# EAGLE design wheel_board_rear (EAGLE 9.5.0)
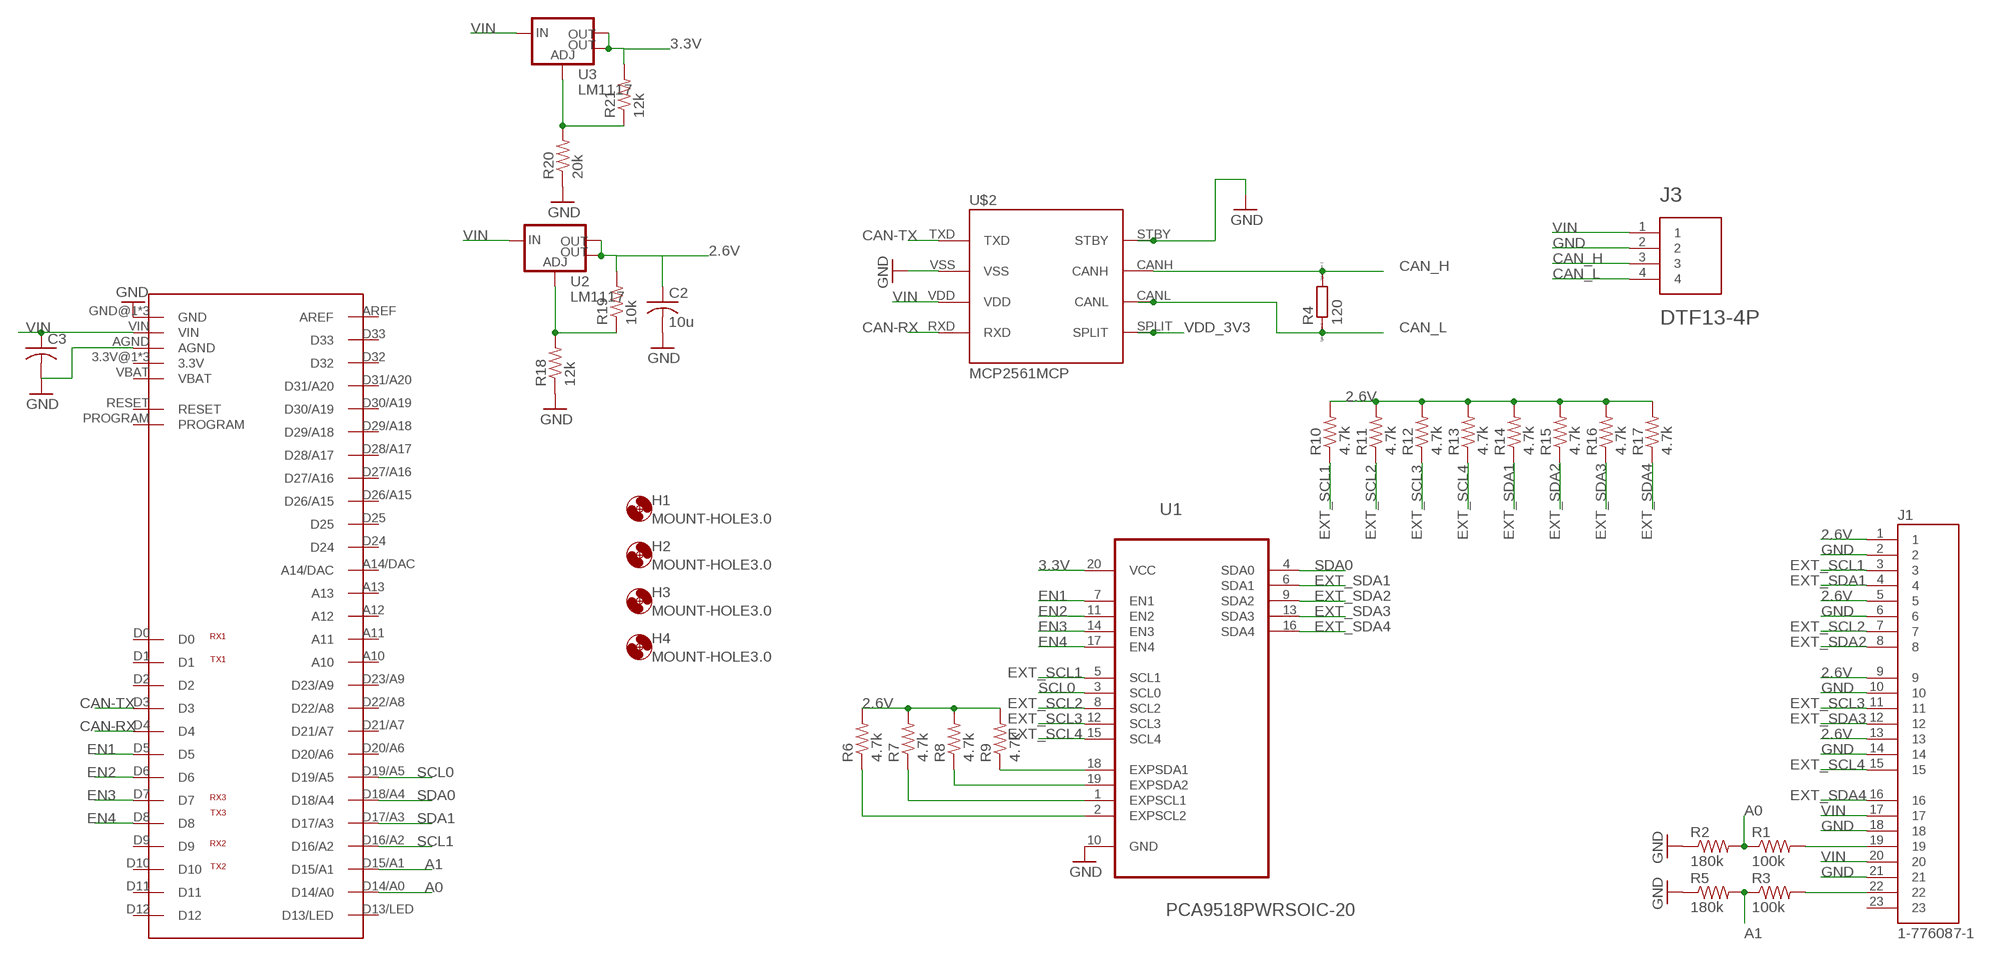
[diagram p0: schematic, sheet 1]

## Parts
C2  10u  C-US050-024X044  [C050-024X044]
C3  C-US050-024X044  [C050-024X044]
H1  MOUNT-HOLE3.0  [3,0]
H2  MOUNT-HOLE3.0  [3,0]
H3  MOUNT-HOLE3.0  [3,0]
H4  MOUNT-HOLE3.0  [3,0]
J1  1-776087-1  [TE_1-776087-1]
J3  DTF13-4P  [TE_DTF13-4P]
R1  100k  R-US_0204/7  [0204/7]
R2  180k  R-US_0204/7  [0204/7]
R3  100k  R-US_0204/7  [0204/7]
R4  120  R  [R0805]
R5  180k  R-US_0204/7  [0204/7]
R6  4.7k  R-US_0204/7  [0204/7]
R7  4.7k  R-US_0204/7  [0204/7]
R8  4.7k  R-US_0204/7  [0204/7]
R9  4.7k  R-US_0204/7  [0204/7]
R10  4.7k  R-US_0204/7  [0204/7]
R11  4.7k  R-US_0204/7  [0204/7]
R12  4.7k  R-US_0204/7  [0204/7]
R13  4.7k  R-US_0204/7  [0204/7]
R14  4.7k  R-US_0204/7  [0204/7]
R15  4.7k  R-US_0204/7  [0204/7]
R16  4.7k  R-US_0204/7  [0204/7]
R17  4.7k  R-US_0204/7  [0204/7]
R18  12k  R-US_0204/7  [0204/7]
R19  10k  R-US_0204/7  [0204/7]
R20  20k  R-US_0204/7  [0204/7]
R21  12k  R-US_0204/7  [0204/7]
U1  PCA9518PWRSOIC-20  [SOIC127P1032X265-20N]
U2  LM1117  V_REG_LM1117SOT223  [SOT223]
U3  LM1117  V_REG_LM1117SOT223  [SOT223]
U$1  TEENSY3.1_ALL  [TEENSY3.1_ALL]
U$2  MCP2561MCP  [MCP2561_PDIP]

## Nets
2.6V [pwr]: C2.1 J1.1 J1.5 J1.9 J1.13 R6.2 R7.2 R8.2 R9.2 R10.2 R11.2 R12.2 R13.2 R14.2 R15.2 R16.2 R17.2 R19.2 U2.2(OUT) U2.4(OUT)
3.3V [pwr]: R21.2 U1.20(VCC) U3.2(OUT) U3.4(OUT)
A0: R1.1 R2.2 U$1.D14/A0
A1: R3.1 R5.2 U$1.D15/A1
CAN-RX: U$1.D4 U$2.RXD
CAN-TX: U$1.D3 U$2.TXD
CAN_H: J3.3 R4.2 U$2.CANH
CAN_L: J3.4 R4.1 U$2.CANL
EN1: U1.7(EN1) U$1.D5
EN2: U1.11(EN2) U$1.D6
EN3: U1.14(EN3) U$1.D7
EN4: U1.17(EN4) U$1.D8
EXT_SCL1: J1.3 R10.1 U1.5(SCL1)
EXT_SCL2: J1.7 R11.1 U1.8(SCL2)
EXT_SCL3: J1.11 R12.1 U1.12(SCL3)
EXT_SCL4: J1.15 R13.1 U1.15(SCL4)
EXT_SDA1: J1.4 R14.1 U1.6(SDA1)
EXT_SDA2: J1.8 R15.1 U1.9(SDA2)
EXT_SDA3: J1.12 R16.1 U1.13(SDA3)
EXT_SDA4: J1.16 R17.1 U1.16(SDA4)
GND [pwr]: C2.2 C3.2 J1.2 J1.6 J1.10 J1.14 J1.18 J1.21 J3.2 R2.1 R5.1 R18.1 R20.1 U1.10(GND) U$1.AGND U$1.GND@1(GND) U$1.GND@2(GND) U$1.GND@3(GND) U$2.STBY U$2.VSS
N$1: R9.1 U1.18(EXPSDA1)
N$2: R8.1 U1.19(EXPSDA2)
N$3: R7.1 U1.1(EXPSCL1)
N$4: R6.1 U1.2(EXPSCL2)
N$5 [pwr]: R20.2 R21.1 U3.1(ADJ)
N$6: J1.19 R1.2
N$7: J1.22 R3.2
N$14 [pwr]: R18.2 R19.1 U2.1(ADJ)
SCL0: U1.3(SCL0) U$1.D19/A5
SCL1: U$1.D16/A2
SDA0: U1.4(SDA0) U$1.D18/A4
SDA1: U$1.D17/A3
VDD_3V3: U$2.SPLIT
VIN [pwr]: C3.1 J1.17 J1.20 J3.1 U2.3(IN) U3.3(IN) U$1.VIN U$2.VDD
Unconnected: J1.23 U$1.3.3V@1(3.3V) U$1.3.3V@2(3.3V) U$1.3.3V@3(3.3V) U$1.A10 U$1.A11 U$1.A12 U$1.A13 U$1.A14/DAC U$1.AREF U$1.D0 U$1.D1 U$1.D2 U$1.D9 U$1.D10 U$1.D11 U$1.D12 U$1.D13/LED U$1.D20/A6 U$1.D21/A7 U$1.D22/A8 U$1.D23/A9 U$1.D24 U$1.D25 U$1.D26/A15 U$1.D27/A16 U$1.D28/A17 U$1.D29/A18 U$1.D30/A19 U$1.D31/A20 U$1.D32 U$1.D33 U$1.PROGRAM U$1.RESET U$1.VBAT

## Library data of the parts
C2 C3 = rcl:C-US: CAPACITOR, American symbol; SPICEPREFIX: C
H1-H4 = holes:MOUNT-HOLE: MOUNTING HOLE with drill center marker
J1 = 1-776087-1:1-776087-1: 23 Positions Header Connector 0.157" (4.00mm) Panel Mount, Through Hole, Right Angle Gold-Palladium, Black; AVAILABILITY: Unavailable; COMMENT: 1-776087-1; DESCRIPTION: AMPSEAL Series; 4mm Pitch 23 Way 3 Row Right Angle PCB Header; Solder Term; 8A; EU_ROHS_COMPLIANCE: Compliant; MF: TE Connectivity; MP: 1-776087-1; PACKAGE: None; PRICE: None; TE_PURCHASE_URL: https://www.te.com/usa-en/product-1-776087-1.html?te_bu=Cor&te_type=disp&te_campaign=seda_glo_cor-seda-global-disp-prtnr-fy19-seda-model-bom-cta_sma-317_1&elqCampaignId=32493
J3 = DTF13-4P:DTF13-4P: none; AVAILABILITY: In stock; MF: TE Connectivity; MPN: DTF13-4P; PARTREV: NC; STANDARD: Manufacturer recommendation
R1-R3 R5-R21 = rcl:R-US_: RESISTOR, American symbol; SPICEPREFIX: R
R4 = eagle-ltspice:R: RESISTOR, European symbol; SPICEMODEL: NONE; SPICEPREFIX: R
U1 = PCA9518PWR:PCA9518PWR: EXPANDABLE FIVE-CHANNEL I2C HUB
U2 U3 = SparkFun-IC-Power:V_REG_LM1117: Voltage Regulator LM1117 Standard adjustable voltage regulator but in SMD form. Spark Fun Electronics SKU : COM-00595; PROD_ID: VREG-08170
U$1 = Teensy3.1:TEENSY3.1_ALL
U$2 = PoJD:MCP2561: High-Speed CAN Transceiver See http://ww1.microchip.com/downloads/en/DeviceDoc/25167A.pdf The MCP2561/2 is a Microchip Technology Inc. second generation high-speed CAN transceiver. It serves as an interface between a CAN protocol controller and the physical two-wire CAN bus. The device meets the automotive requirements for high-speed (up to 1 Mb/s), low quiescent current, electromagnetic compatibility (EMC) and electrostatic discharge (ESD).

## Net classes
0 default: width 0.508 mm, drill 0.254 mm
1 pwr: width 1.143 mm, clearance 0.381 mm

## Board
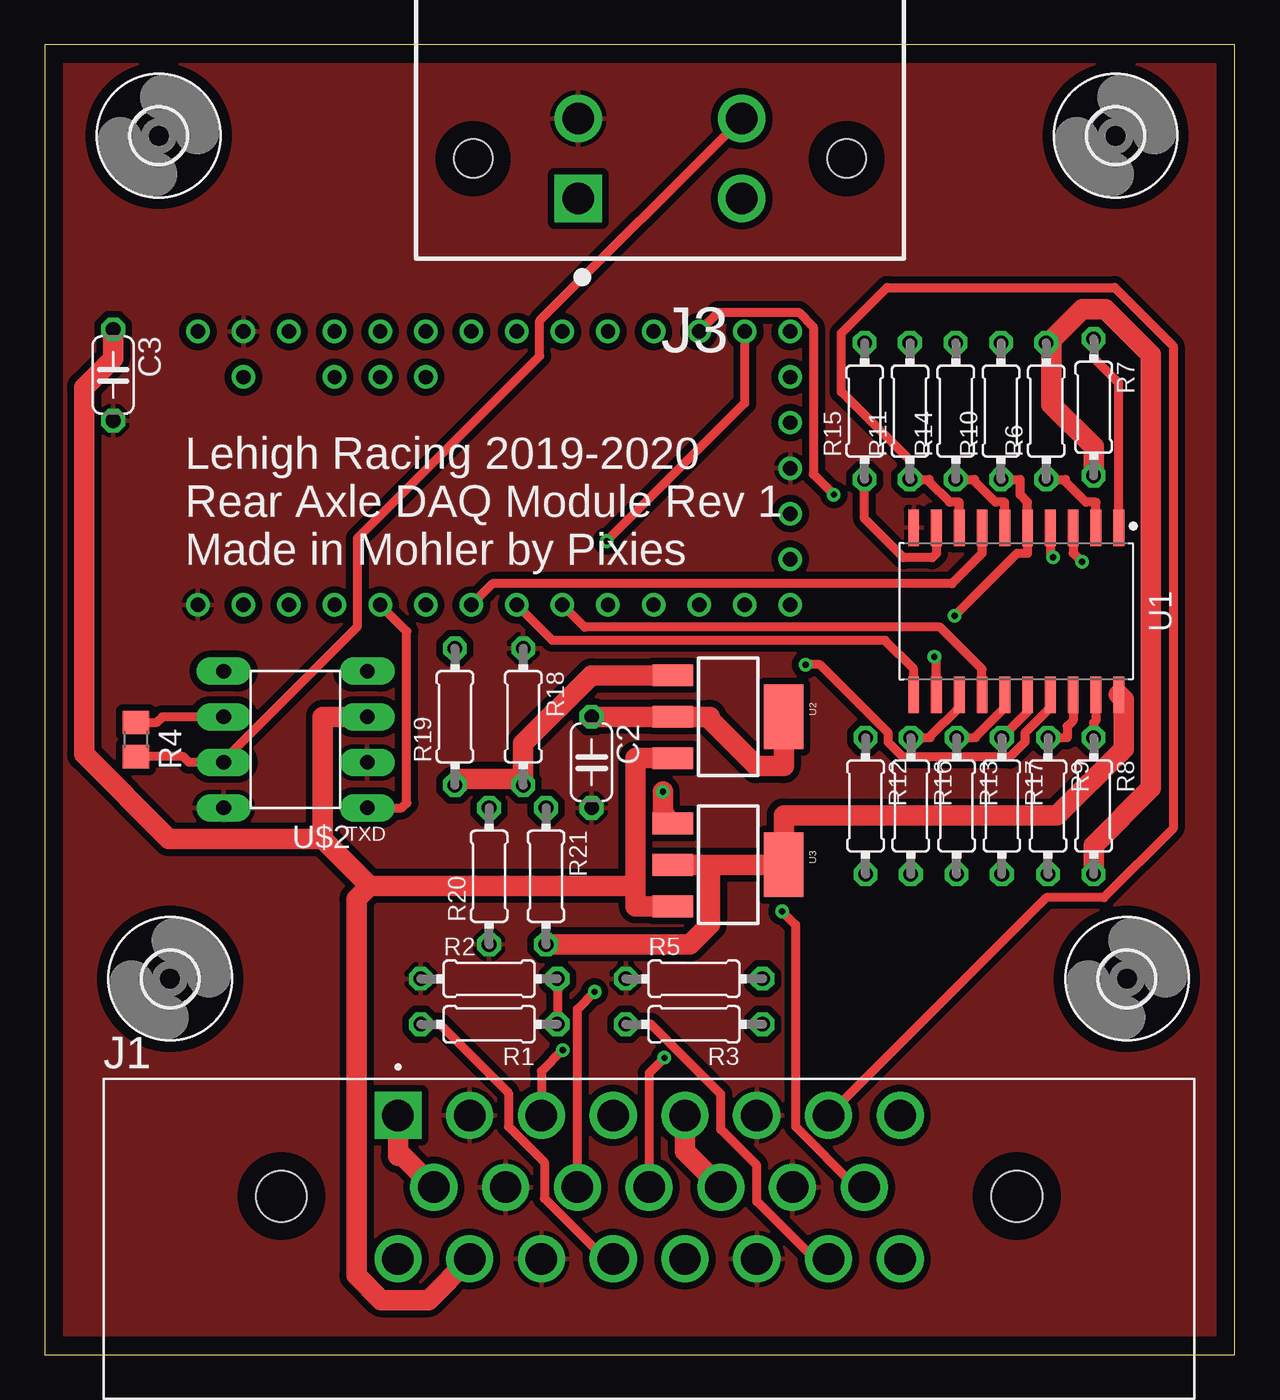
[diagram p1: board, top side]
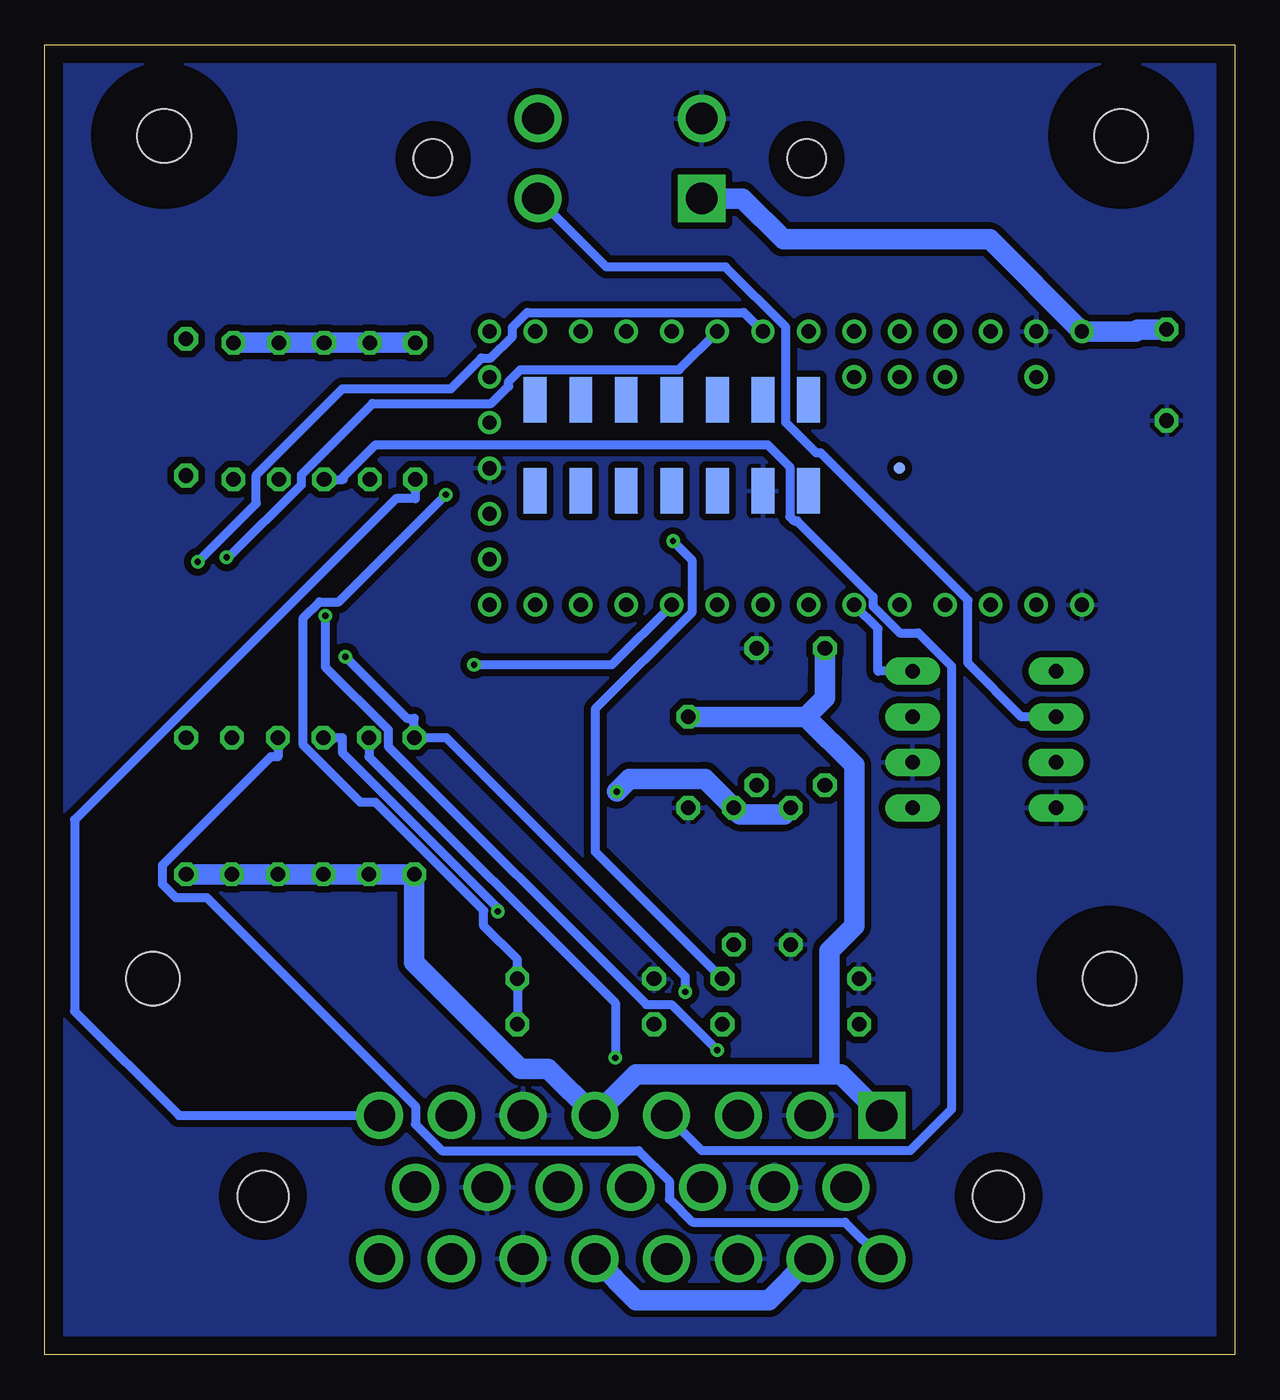
[diagram p2: board, bottom side, seen from below]

Size 66.34 x 73.02 mm. Coordinates in mm from the lower left corner, seen from the top.
Outline: 0,0 66.34,0 66.34,73.02 0,73.02 0,0
Copper layers (1*16): Top 0.035mm / dielectric 1.5mm / Bottom 0.035mm
Design rules "default": minimum track width 6mil, minimum drill 0.35mm, track to track 6mil, track to pad 6mil, pad to pad 6mil, via to via 6mil, smd to smd 6mil, copper to edge 40mil, drill to drill 6mil, minimum pad ring 10mil, minimum via ring 8mil, stop-mask expansion 4mil, vias tented up to drill 0mil, thermal gap 10mil

### Footprints (pad centres in the part's own frame; a part is rotated, then mirrored left to right if it is on the bottom)
C050-024X044 = drill 0.813 octagon: 1 -2.54,0; 2 2.54,0
3,0 = hole 3: 0,0
TE_1-776087-1 = drill 1.75 square: 1 0,0 | drill 1.75: 2 4,0; 3 8,0; 4 12,0; 5 16,0; 6 20,0; 7 24,0; 8 28,0; 9 2,-4; 10 6,-4; 11 10,-4; 12 14,-4; 13 18,-4; 14 22,-4; 15 26,-4; 16 0,-8; 17 4,-8; 18 8,-8; 19 12,-8; 20 16,-8; 21 20,-8; 22 24,-8; 23 28,-8 | hole 2.85: -6.5,-4.5; 34.5,-4.5
TE_DTF13-4P = drill 1.76 square: 1 4.561,2.223 | drill 1.76: 2 4.561,-2.227; 3 -4.559,-2.227; 4 -4.559,2.223 | hole 2.16: -10.415,0; 10.415,0
0204/7 = drill 0.813 octagon: 1 -3.81,0; 2 3.81,0
R0805 = smd 1.3 x 1.5: 1 -0.95,0; 2 0.95,0
SOIC127P1032X265-20N = smd 2.052 x 0.602: 1 -4.654,5.715; 2 -4.654,4.445; 3 -4.654,3.175; 4 -4.654,1.905; 5 -4.654,0.635; 6 -4.654,-0.635; 7 -4.654,-1.905; 8 -4.654,-3.175; 9 -4.654,-4.445; 10 -4.654,-5.715; 11 4.654,-5.715; 12 4.654,-4.445; 13 4.654,-3.175; 14 4.654,-1.905; 15 4.654,-0.635; 16 4.654,0.635; 17 4.654,1.905; 18 4.654,3.175; 19 4.654,4.445; 20 4.654,5.715
SOT223 = smd 1.219 x 2.235: 1 -2.311,-3.099; 2 0,-3.099; 3 2.311,-3.099 | smd 3.6 x 2.2: 4 0,3.099
TEENSY3.1_ALL = drill 0.8: 3.3V@1 2.54,5.08; 3.3V@2 -7.62,-22.86; A10 0,0; A11 0,-2.54; A14/DAC 0,-22.86; AGND 2.54,7.62; AREF 0,2.54; D0 -12.7,7.62; D1 -12.7,5.08; D2 -12.7,2.54; D3 -12.7,0; D4 -12.7,-2.54; D5 -12.7,-5.08; D6 -12.7,-7.62; D7 -12.7,-10.16; D8 -12.7,-12.7; D9 -12.7,-15.24; D10 -12.7,-17.78; D11 -12.7,-20.32; D12 -12.7,-22.86; D13/LED 2.54,-22.86; D14/A0 2.54,-20.32; D15/A1 2.54,-17.78; D16/A2 2.54,-15.24; D17/A3 2.54,-12.7; D18/A4 2.54,-10.16; D19/A5 2.54,-7.62; D20/A6 2.54,-5.08; D21/A7 2.54,-2.54; D22/A8 2.54,0; D23/A9 2.54,2.54; GND@1 -12.7,10.16; GND@2 -5.08,-22.86; PROGRAM -2.54,-22.86; VBAT -10.16,-22.86; VIN 2.54,10.16; VUSB 0,7.62 | smd 2.54 x 1.27 bottom: 3.3V@3 -1.27,-7.62; A12 -6.35,-5.08; A13 -1.27,-5.08; D24 -6.35,-10.16; D25 -6.35,-12.7; D26/A15 -6.35,-15.24; D27/A16 -6.35,-17.78; D28/A17 -6.35,-20.32; D29/A18 -1.27,-20.32; D30/A19 -1.27,-17.78; D31/A20 -1.27,-15.24; D32 -1.27,-12.7; D33 -1.27,-10.16; GND@3 -6.35,-7.62 | smd 0.635 x 0.635 bottom: RESET -5.08,0
MCP2561_PDIP = drill 0.813 pad 1.524 long: CANH 4,1.27; CANL 4,-1.27; RXD -4,-3.81; SPLIT 4,-3.81; STBY 4,3.81; TXD -4,3.81; VDD -4,-1.27; VSS -4,1.27

### Placement (x,y rotation side)
C2  30.48,33.02 270 top
C3  3.81,54.61 270 top
H1  60.33,20.96 0 top
H2  6.98,20.96 0 top
H3  59.69,67.95 0 top
H4  6.35,67.95 0 top
J1  19.68,13.34 0 top
J3  34.29,66.67 180 top
R1  24.77,18.41 180 top
R2  24.77,20.96 0 top
R3  36.2,18.41 180 top
R4  5.08,34.29 270 top
R5  36.2,20.96 0 top
R6  55.83,52.6 90 top
R7  58.47,52.81 270 top
R8  58.47,30.59 270 top
R9  55.92,30.59 270 top
R10  53.3,52.6 90 top
R11  48.23,52.6 90 top
R12  45.75,30.59 270 top
R13  50.83,30.59 270 top
R14  50.78,52.6 90 top
R15  45.7,52.6 90 top
R16  48.27,30.59 270 top
R17  53.35,30.59 270 top
R18  26.67,35.56 270 top
R19  22.86,35.56 90 top
R20  24.77,26.67 90 top
R21  27.94,26.67 270 top
U1  54.15,41.44 270 top
U2  38.1,35.56 270 top
U3  38.1,27.3 270 top
U$1  18.69,54.5 90 top
U$2  13.97,34.29 180 top

### Tracks (layer width: path | path; a pad name or v marks a point on that pad's centre or on a via)
2.6V
  Top 1.143: U2.4 41.2,32.81 39.66,32.81 37.07,35.4 37.07,35.56 U2.2 C2.1 | 56.11,56.41 56.11,52.97 58.47,50.62 R7.2 | 56.11,56.41 56.11,56.55 57.85,58.28 59.12,58.28 61.66,55.74 61.66,31.59 58.47,28.39 R8.2 | 56.11,56.41 R6.2 | J1.1 19.68,11.07 19.95,11.07 J1.9 | J1.13 35.69,11.34 J1.5
  Bottom 1.143: 23.92,35.56 22.86,36.62 22.86,37.76 R19.2 | C2.1 23.92,35.56 | 22.6,15.63 22.6,22.52 21.22,23.9 21.22,32.86 23.92,35.56 | 22.6,15.63 21.98,15.63 J1.1 | 22.6,15.63 33.39,15.63 J1.5 38.29,15.94 39.81,15.94 45.75,21.88 R12.2 46.66,26.78 R16.2 R13.2 R17.2 R9.2 R8.2 | R6.2 R10.2 R14.2 R11.2 R15.2
3.3V
  Top 1.143: U1.20 60.14,36.51 60.14,33.77 56.43,30.06 41.2,30.06 U3.4 37.07,27.3 | 37.07,27.3 37.07,23.97 35.96,22.86 R21.2 | 37.07,27.3 36.69,27.3 U3.2
A0  (via drill 0.35 pad 0.76)
  Top 0.508: U$1.D14/A0 39.01,53.04 v31.33,45.35 | R2.2 R1.1
  Bottom 0.508: v31.33,45.35 30.27,44.3 30.27,41.37 35.66,35.98 35.66,28.04 R2.2
A1  (via drill 0.35 pad 0.76)
  Top 0.508: U$1.D15/A1 37.54,58.1 42.03,58.1 42.84,57.29 42.84,49.09 v43.99,47.94
  Bottom 0.508: v43.99,47.94 49.96,41.97 51.03,41.97 51.93,41.07 51.93,33.98 48.75,30.8 47.92,30.8 41.88,24.76 41.88,23.9 40.01,22.02 R5.2 R3.1
CAN-RX
  Bottom 0.508: U$1.D4 19.9,40.46 19.9,38.1 U$2.RXD
CAN-TX
  Top 0.508: U$2.TXD 19.9,30.48 20.17,30.75 20.17,40.32 U$1.D3
CAN_H
  Top 0.508: 9.67,33.02 9.84,33.02 17.42,40.6 17.42,45.51 27.58,55.67 27.58,57.64 J3.3 | U$2.CANH 9.67,33.02 | 9.67,33.02 8.04,33.02 7.72,33.34 R4.2 | 9.67,33.02
CAN_L
  Top 0.508: R4.1 6.24,35.24 6.56,35.56 U$2.CANL
  Bottom 0.508: U$2.CANL 11.9,35.56 14.88,38.54 14.88,42.05 23.09,50.26 23.34,50.26 25.04,51.97 25.04,57.27 28.4,60.63 35.02,60.63 J3.4
EN1
  Top 0.508: U1.7 52.24,44.66 50.57,42.98 24.96,42.98 U$1.D5
EN2
  Top 0.508: U1.11 48.44,38.22 46.84,39.81 28.3,39.81 U$1.D6
EN3
  Top 0.508: U1.14 52.24,38.22 49.91,40.56 30.09,40.56 U$1.D7
EN4  (via drill 0.35 pad 0.76)
  Top 0.508: U1.17 56.05,36.07 54.64,34.66 54.64,34.16 53.79,33.31 47.83,33.31 47.01,34.14 47.01,34.65 43.2,38.46 v42.42,38.46 | v42.42,38.46
  Bottom 0.508: v42.42,38.46 34.73,38.46 U$1.D8
EXT_SCL1  (via drill 0.35 pad 0.76)
  Top 0.508: R10.1 54.37,48.79 54.37,47.94 54.78,47.53 U1.5 54.78,45.38 54.78,44.66 54.19,44.66 v50.71,41.18 | v28.87,16.98 27.69,15.8 J1.3
  Bottom 0.508: v50.71,41.18 50.71,38.34 47.21,34.84 47.21,33.91 32.82,19.52 31.41,19.52 v28.87,16.98
EXT_SCL2
  Top 0.508: J1.7 55.83,25.48 59.04,25.48 62.9,29.34 62.9,56.23 59.63,59.49 46.95,59.49 44.4,56.94 44.4,53.68 48.23,49.86 R11.1 49.29,48.79 49.29,48.68 50.44,47.53 50.98,47.53 U1.8
EXT_SCL3  (via drill 0.35 pad 0.76)
  Top 0.508: J1.11 29.69,19.26 v30.65,20.22 | U1.12 49.7,38.78 v49.59,38.9
  Bottom 0.508: v49.59,38.9 46.15,35.46 45.75,35.46 R12.1 43.97,34.4 30.65,21.07 v30.65,20.22
EXT_SCL4  (via drill 0.35 pad 0.76)
  Top 0.508: v41.1,24.71 41.85,23.96 41.85,12.71 45.23,9.34 J1.15 | U1.15 53.52,36.07 51.89,34.45 51.89,34.4 R13.1
  Bottom 0.508: R13.1 49.76,34.4 49.76,33.57 41.1,24.91 v41.1,24.71
EXT_SDA1
  Top 0.508: R14.1 51.84,48.79 51.84,48.68 53,47.53 53.52,47.53 U1.6
  Bottom 0.508: R14.1 49.71,48.79 49.71,48.92 47.9,50.73 26.06,50.73 24.81,49.49 24.81,46.71 24.58,46.47 24.41,46.47 20.17,42.24 20.17,41.72 18.68,40.24 17.66,40.24 15.8,38.38 15.8,13.68 18.12,11.37 29.72,11.37 J1.4
EXT_SDA2
  Top 0.508: U1.9 49.7,44.66 49.48,44.43 47.87,44.43 45.7,46.6 R15.1
  Bottom 0.508: R15.1 45.7,47.72 46.77,47.72 64.68,29.81 64.68,19.15 58.87,13.34 J1.8
EXT_SDA3  (via drill 0.35 pad 0.76)
  Top 0.508: v34.54,16.55 33.69,15.69 J1.12 | R16.1 49.34,34.4 49.34,34.45 50.98,36.08 U1.13
  Bottom 0.508: R16.1 48.27,33.33 34.54,19.6 v34.54,16.55 | v34.54,16.55
EXT_SDA4
  Top 0.508: U1.16 54.78,35.83 R17.1
  Bottom 0.508: R17.1 53.35,33.33 53.75,33.33 59.8,27.28 59.8,26.23 59.04,25.48 57.32,25.48 45.69,13.85 45.69,12.85 44.2,11.37 33.24,11.37 31.53,9.66 31.53,8.68 30.24,7.39 21.74,7.39 J1.16
GND
  pour Top: 0,73.03 66.67,73.03 66.67,0 0,0
  pour Bottom: 0,73.03 66.67,73.03 66.67,0 0,0
N$1
  Top 0.508: R9.1 56.99,34.4 56.99,35.02 57.33,35.35 U1.18
N$2
  Top 0.508: U1.19 58.59,35.35 58.47,35.23 R8.1
N$3
  Top 0.508: R7.1 58.47,55.55 59.86,54.16 U1.1
N$4
  Top 0.508: R6.1 56.89,48.79 56.89,48.68 58.04,47.53 58.59,47.53 U1.2
N$5  (via drill 0.35 pad 0.76)
  Top 1.143: U3.1 34.46,30.16 v34.46,31.39
  Bottom 1.143: v34.46,31.39 33.75,32.09 29.55,32.09 R21.1 27.59,30.12 25.12,30.12 R20.2
N$6
  Top 0.508: R1.2 22.02,18.41 25.85,14.59 25.85,12.71 27.85,10.71 27.85,8.71 31.23,5.33 J1.19
N$7
  Top 0.508: J1.22 42.9,5.33 39.69,8.55 39.69,10.55 37.69,12.55 37.69,14.51 33.78,18.41 33.45,18.41 R3.2
N$14
  Top 1.143: 26.67,32.1 26.67,34.06 30.48,37.87 U2.1 | R18.2 26.67,32.1 | 26.67,32.1 23.21,32.1 R19.1
SCL0  (via drill 0.35 pad 0.76)
  Top 0.508: U1.3 57.33,44.66 57.35,44.66 v57.82,44.19
  Bottom 0.508: v57.82,44.19 54.56,47.45 54.56,49.04 49.76,53.84 43.71,53.84 42,55.56 41.49,55.56 40.28,56.76 40.28,57.27 39.46,58.1 27.37,58.1 U$1.D19/A5
SDA0  (via drill 0.35 pad 0.76)
  Top 0.508: U1.4 56.05,44.66 56.21,44.5 v56.21,44.45
  Bottom 0.508: v56.21,44.45 56.08,44.45 52.04,48.49 52.04,49.05 48.08,53.02 41.46,53.02 40.49,53.99 40.49,54.25 39.84,54.9 30.99,54.9 U$1.D18/A4
VIN
  Top 1.143: 32.93,26.13 32.93,33.25 U2.3 | 32.93,26.13 32.93,24.99 U3.3 | 32.93,26.13 18.1,26.13 | 18.1,26.13 17.37,25.4 17.37,4.42 18.75,3.04 21.39,3.04 J1.17 | 15.49,28.74 18.1,26.13 | 15.49,28.74 15.49,35.56 U$2.VDD | 15.49,28.74 6.91,28.74 2.18,33.47 2.18,53.91 3.81,55.54 C3.1
  Bottom 1.143: J3.1 27.46,64.45 25.18,62.18 13.68,62.18 U$1.VIN 5.54,57.04 5.42,57.15 C3.1 | J1.17 25.98,3.04 33.39,3.04 J1.20

### Text on the board
tPlace: Lehigh Racing 2019-2020 / Rear Axle DAQ Module Rev 1 / Made in Mohler by Pixies